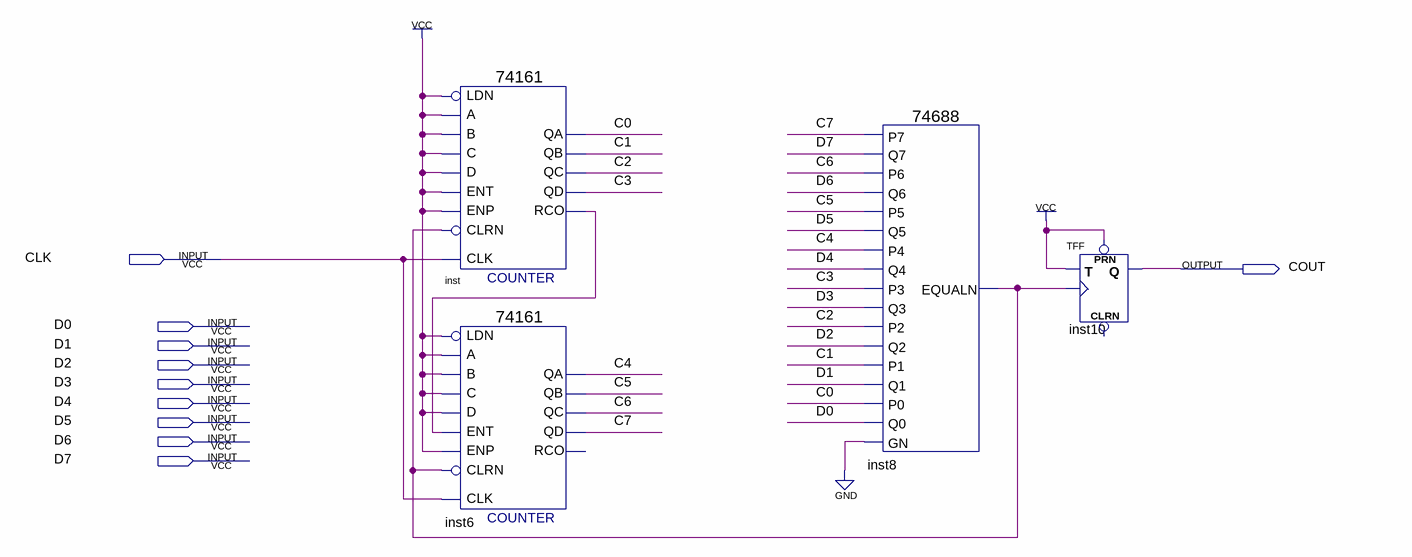
[diagram p0: schematic sheet]
// Quartus schematic DivCLK.bdf as structural Verilog: 4 symbols, 10 pins
module DivCLK (
  input  CLK,
  input  D0,
  input  D1,
  input  D2,
  input  D3,
  input  D4,
  input  D5,
  input  D6,
  input  D7,
  output COUT
);

  wire C0, C1, C2, C3, C4, C5, C6, C7, inst8_equaln, inst_rco;

  \74161  inst (
    .CLRN(inst8_equaln), .CLK(CLK), .ENP(1'b1), .LDN(1'b1), .A(1'b1), .D(1'b1), .ENT(1'b1), .B(1'b1),
    .C(1'b1), .QD(C3), .QC(C2), .QB(C1), .QA(C0), .RCO(inst_rco));
  \74161  inst6 (
    .CLRN(inst8_equaln), .CLK(CLK), .ENP(1'b1), .LDN(1'b1), .A(1'b1), .D(1'b1), .ENT(inst_rco), .B(1'b1),
    .C(1'b1), .QD(C7), .QC(C6), .QB(C5), .QA(C4));  // open: RCO
  \74688  inst8 (
    .P6(C6), .Q3(D3), .P3(C3), .Q4(D4), .P4(C4), .Q2(D2), .P1(C1), .Q1(D1), .P0(C0), .Q0(D0), .P2(C2),
    .GN(1'b0), .Q7(D7), .Q5(D5), .P5(C5), .Q6(D6), .P7(C7), .EQUALN(inst8_equaln));
  TFF inst10 (.PRN(1'b1), .T(1'b1), .CLK(inst8_equaln), .Q(COUT));  // open: CLRN
endmodule
